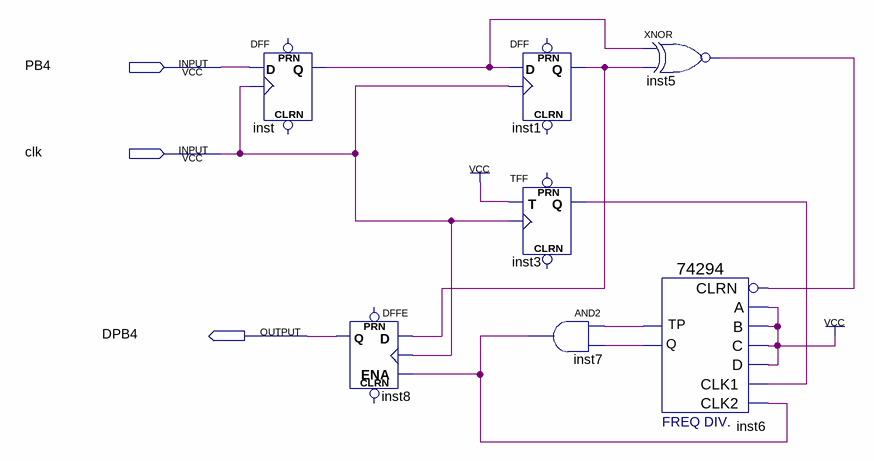
[diagram p0: schematic sheet]
// Quartus schematic Debouncer.bdf as structural Verilog: 7 symbols, 3 pins
module Debouncer (
  input  PB4,
  input  clk,
  output DPB4
);

  wire inst1_q, inst3_q, inst5_out, inst6_q, inst6_tp, inst7_out, inst_q;

  DFF inst (.CLK(clk), .D(PB4), .Q(inst_q));  // open: CLRN, PRN
  DFFE inst8 (.D(inst1_q), .CLK(clk), .ENA(inst7_out), .Q(DPB4));  // open: PRN, CLRN
  DFF inst1 (.CLK(clk), .D(inst_q), .Q(inst1_q));  // open: CLRN, PRN
  TFF inst3 (.T(1'b1), .CLK(clk), .Q(inst3_q));  // open: PRN, CLRN
  and inst7 (inst7_out, inst6_tp, inst6_q);
  xnor inst5 (inst5_out, inst_q, inst1_q);
  \74294  inst6 (
    .A(1'b1), .B(1'b1), .C(1'b1), .CLK1(inst3_q), .CLK2(inst7_out), .CLRN(inst5_out), .D(1'b1), .Q(inst6_q),
    .TP(inst6_tp));
endmodule
